# EAGLE design untitled (EAGLE 9.3.2)
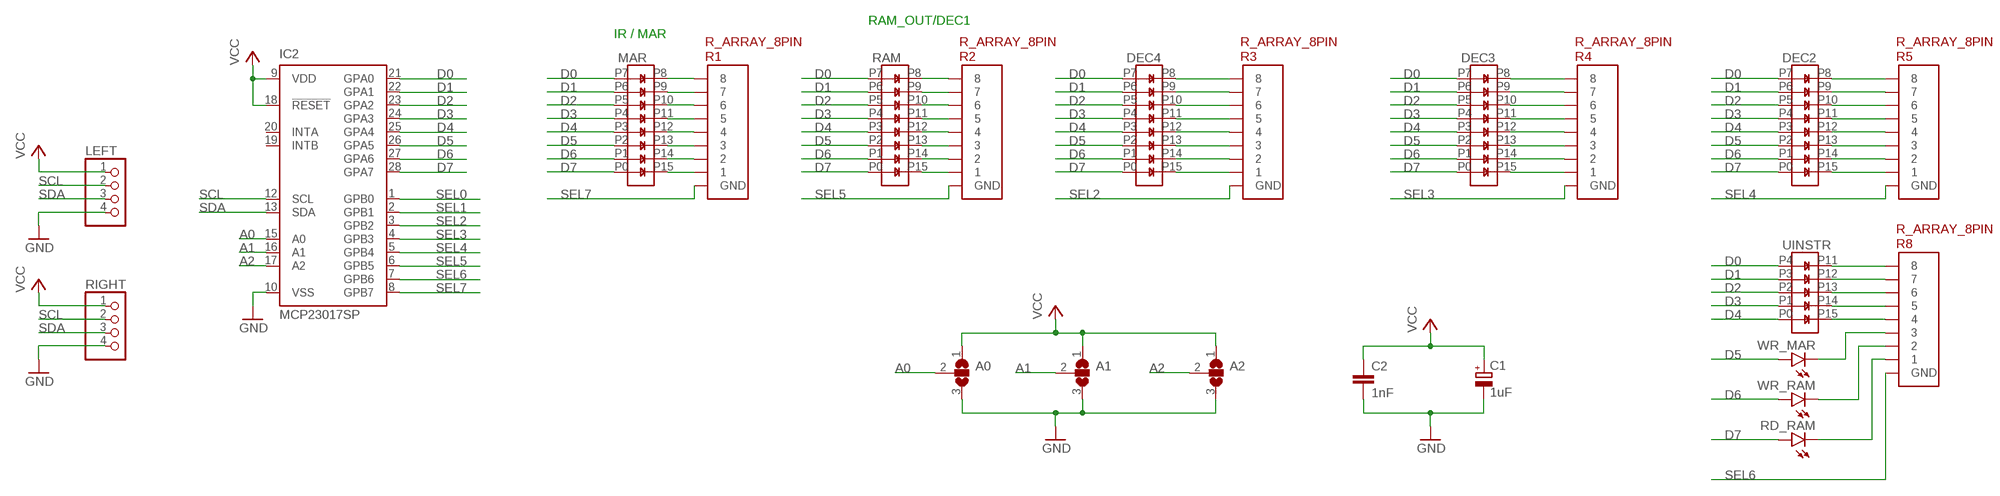
[diagram p0: schematic, sheet 1]

## Parts
A0  SJ2W  [SJ_2]
A1  SJ2W  [SJ_2]
A2  SJ2W  [SJ_2]
C1  1uF  CPOL-EUE2.5-6  [E2,5-6]
C2  1nF  C2.5/2  [C2.5-2]
DEC2  LB8  [LB8]
DEC3  LB8  [LB8]
DEC4  LB8  [LB8]
IC2  MCP23017SP  [DIL28-3]
LEFT  PINHD-1X4  [1X04]
MAR  LB8  [LB8]
R1  R_ARRAY_8PIN  [R_ARRAY_8PIN]
R2  R_ARRAY_8PIN  [R_ARRAY_8PIN]
R3  R_ARRAY_8PIN  [R_ARRAY_8PIN]
R4  R_ARRAY_8PIN  [R_ARRAY_8PIN]
R5  R_ARRAY_8PIN  [R_ARRAY_8PIN]
R8  R_ARRAY_8PIN  [R_ARRAY_8PIN]
RAM  LB8  [LB8]
RD_RAM  LED3MM  [LED3MM]
RIGHT  PINHD-1X4  [1X04]
UINSTR  LB5  [LB5]
WR_MAR  LED3MM  [LED3MM]
WR_RAM  LED3MM  [LED3MM]

## Nets
A0: A0.2 IC2.15(A0)
A1: A1.2 IC2.16(A1)
A2: A2.2 IC2.17(A2)
D0: DEC2.P7 DEC3.P7 DEC4.P7 IC2.21(GPA0) MAR.P7 RAM.P7 UINSTR.P4
D1: DEC2.P6 DEC3.P6 DEC4.P6 IC2.22(GPA1) MAR.P6 RAM.P6 UINSTR.P3
D2: DEC2.P5 DEC3.P5 DEC4.P5 IC2.23(GPA2) MAR.P5 RAM.P5 UINSTR.P2
D3: DEC2.P4 DEC3.P4 DEC4.P4 IC2.24(GPA3) MAR.P4 RAM.P4 UINSTR.P1
D4: DEC2.P3 DEC3.P3 DEC4.P3 IC2.25(GPA4) MAR.P3 RAM.P3 UINSTR.P0
D5: DEC2.P2 DEC3.P2 DEC4.P2 IC2.26(GPA5) MAR.P2 RAM.P2 WR_MAR.A
D6: DEC2.P1 DEC3.P1 DEC4.P1 IC2.27(GPA6) MAR.P1 RAM.P1 WR_RAM.A
D7: DEC2.P0 DEC3.P0 DEC4.P0 IC2.28(GPA7) MAR.P0 RAM.P0 RD_RAM.A
GND: A0.3 A1.3 A2.3 C1.- C2.2 IC2.10(VSS) LEFT.4 RIGHT.4
N$1: DEC4.P8 R3.8
N$2: DEC4.P9 R3.7
N$3: DEC4.P10 R3.6
N$4: DEC4.P11 R3.5
N$5: DEC4.P12 R3.4
N$6: DEC4.P13 R3.3
N$7: DEC4.P14 R3.2
N$8: DEC4.P15 R3.1
N$9: R8.3 WR_MAR.K(C)
N$10: R8.2 WR_RAM.K(C)
N$11: R8.1 RD_RAM.K(C)
N$17: MAR.P8 R1.8
N$18: MAR.P9 R1.7
N$19: MAR.P10 R1.6
N$20: MAR.P11 R1.5
N$21: MAR.P12 R1.4
N$22: MAR.P13 R1.3
N$23: MAR.P14 R1.2
N$24: MAR.P15 R1.1
N$25: R2.8 RAM.P8
N$26: R2.7 RAM.P9
N$27: R2.6 RAM.P10
N$28: R2.5 RAM.P11
N$29: R2.4 RAM.P12
N$30: R2.3 RAM.P13
N$31: R2.2 RAM.P14
N$32: R2.1 RAM.P15
N$42: DEC3.P8 R4.8
N$43: DEC3.P9 R4.7
N$44: DEC3.P10 R4.6
N$45: DEC3.P11 R4.5
N$46: DEC3.P12 R4.4
N$47: DEC3.P13 R4.3
N$48: DEC3.P14 R4.2
N$49: DEC3.P15 R4.1
N$50: DEC2.P8 R5.8
N$51: DEC2.P9 R5.7
N$52: DEC2.P10 R5.6
N$53: DEC2.P11 R5.5
N$54: DEC2.P12 R5.4
N$55: DEC2.P13 R5.3
N$56: DEC2.P14 R5.2
N$57: DEC2.P15 R5.1
N$58: R8.8 UINSTR.P11
N$59: R8.7 UINSTR.P12
N$60: R8.6 UINSTR.P13
N$61: R8.5 UINSTR.P14
N$62: R8.4 UINSTR.P15
SCL: IC2.12(SCL) LEFT.2 RIGHT.2
SDA: IC2.13(SDA) LEFT.3 RIGHT.3
SEL0: IC2.1(GPB0)
SEL1: IC2.2(GPB1)
SEL2: IC2.3(GPB2) R3.GND
SEL3: IC2.4(GPB3) R4.GND
SEL4: IC2.5(GPB4) R5.GND
SEL5: IC2.6(GPB5) R2.GND
SEL6: IC2.7(GPB6) R8.GND
SEL7: IC2.8(GPB7) R1.GND
VCC: A0.1 A1.1 A2.1 C1.+ C2.1 IC2.9(VDD) IC2.18(!RESET) LEFT.1 RIGHT.1
Unconnected: IC2.19(INTB) IC2.20(INTA)

## Notes on the sheet
- RAM_OUT/DEC1
- IR / MAR

## Library data of the parts
A0 A1 A2 = jumper:SJ2W: SMD solder JUMPER
C1 = rcl:CPOL-EU: POLARIZED CAPACITOR, European symbol; SPICEPREFIX: C
C2 = capacitor-wima:C: CAPACITOR naming: grid - package width
DEC2-DEC4 MAR RAM = 8bit_components:LB8
IC2 = microchip:MCP23017: http://ww1.microchip.com/downloads/en/DeviceDoc/21952a.pdf Source: http://ww1.microchip.com/downloads/en/DeviceDoc/21952a.pdf; MF: MICROCHIP; MPN: MCP23017-E/SP; OC_FARNELL: 1332088; OC_NEWARK: 31K2959
LEFT RIGHT = pinhead:PINHD-1X4: PIN HEADER
R1-R5 R8 = 8bit_components:R_ARRAY_8PIN
RD_RAM WR_MAR WR_RAM = led:LED: LED OSRAM: - CHIPLED LG R971, LG N971, LY N971, LG Q971, LY Q971, LO R971, LY R971 LH N974, LH R974 LS Q976, LO Q976, LY Q976 LO Q996 - Hyper CHIPLED LW Q18S LB Q993, LB Q99A, LB R99A - SideLED LS A670, LO A670, LY A670, LG A670, LP A670 LB A673, LV A673, LT A673, LW A673 LH A674 LY A675 LS A676, LA A676, LO A676, LY A676, LW A676 LS A679, LY A679, LG A679 - Hyper Micro SIDELED® LS Y876, LA Y876, LO Y876, LY Y876 LT Y87S - SmartLED LW L88C, LW L88S LB L89C, LB L89S, LG L890 LS L89K, LO L89K, LY L89K LS L896, LA L896, LO L896, LY L896 - TOPLED LS T670, LO T670, LY T670, LG T670, LP T670 LSG T670, LSP T670, LSY T670, LOP T670, LYG T670 LG T671, LOG T671, LSG T671 LB T673, LV T673, LT T673, LW T673 LH T674 LS T676, LA T676, LO T676, LY T676, LB T676, LH T676, LSB T676, LW T676 LB T67C, LV T67C, LT T67C, LS T67K, LO T67K, LY T67K, LW E67C LS E67B, LA E67B, LO E67B, LY E67B, LB E67C, LV E67C, LT E67C LW T67C LS T679, LY T679, LG T679 LS T770, LO T770, LY T770, LG T770, LP T770 LB T773, LV T773, LT T773, LW T773 LH T774 LS E675, LA E675, LY E675, LS T675 LS T776, LA T776, LO T776, LY T776, LB T776 LHGB T686 LT T68C, LB T68C - Hyper Mini TOPLED® LB M676 - Mini TOPLED Santana® LG M470 LS M47K, LO M47K, LY M47K Source: http://www.osram.convergy.de LUXEON: - LUMILED® LXK2-PW12-R00, LXK2-PW12-S00, LXK2-PW14-U00, LXK2-PW14-V00 LXK2-PM12-R00, LXK2-PM12-S00, LXK2-PM14-U00 LXK2-PE12-Q00, LXK2-PE12-R00, LXK2-PE12-S00, LXK2-PE14-T00, LXK2-PE14-U00 LXK2-PB12-K00, LXK2-PB12-L00, LXK2-PB12-M00, LXK2-PB14-N00, LXK2-PB14-P00, LXK2-PB14-Q00 LXK2-PR12-L00, LXK2-PR12-M00, LXK2-PR14-Q00, LXK2-PR14-R00 LXK2-PD12-Q00, LXK2-PD12-R00, LXK2-PD12-S00 LXK2-PH12-R00, LXK2-PH12-S00 LXK2-PL12-P00, LXK2-PL12-Q00, LXK2-PL12-R00 Source: www.luxeon.com KINGBRIGHT: KA-3528ASYC Source: www.kingbright.com
UINSTR = 8bit_components:LB5

## Board
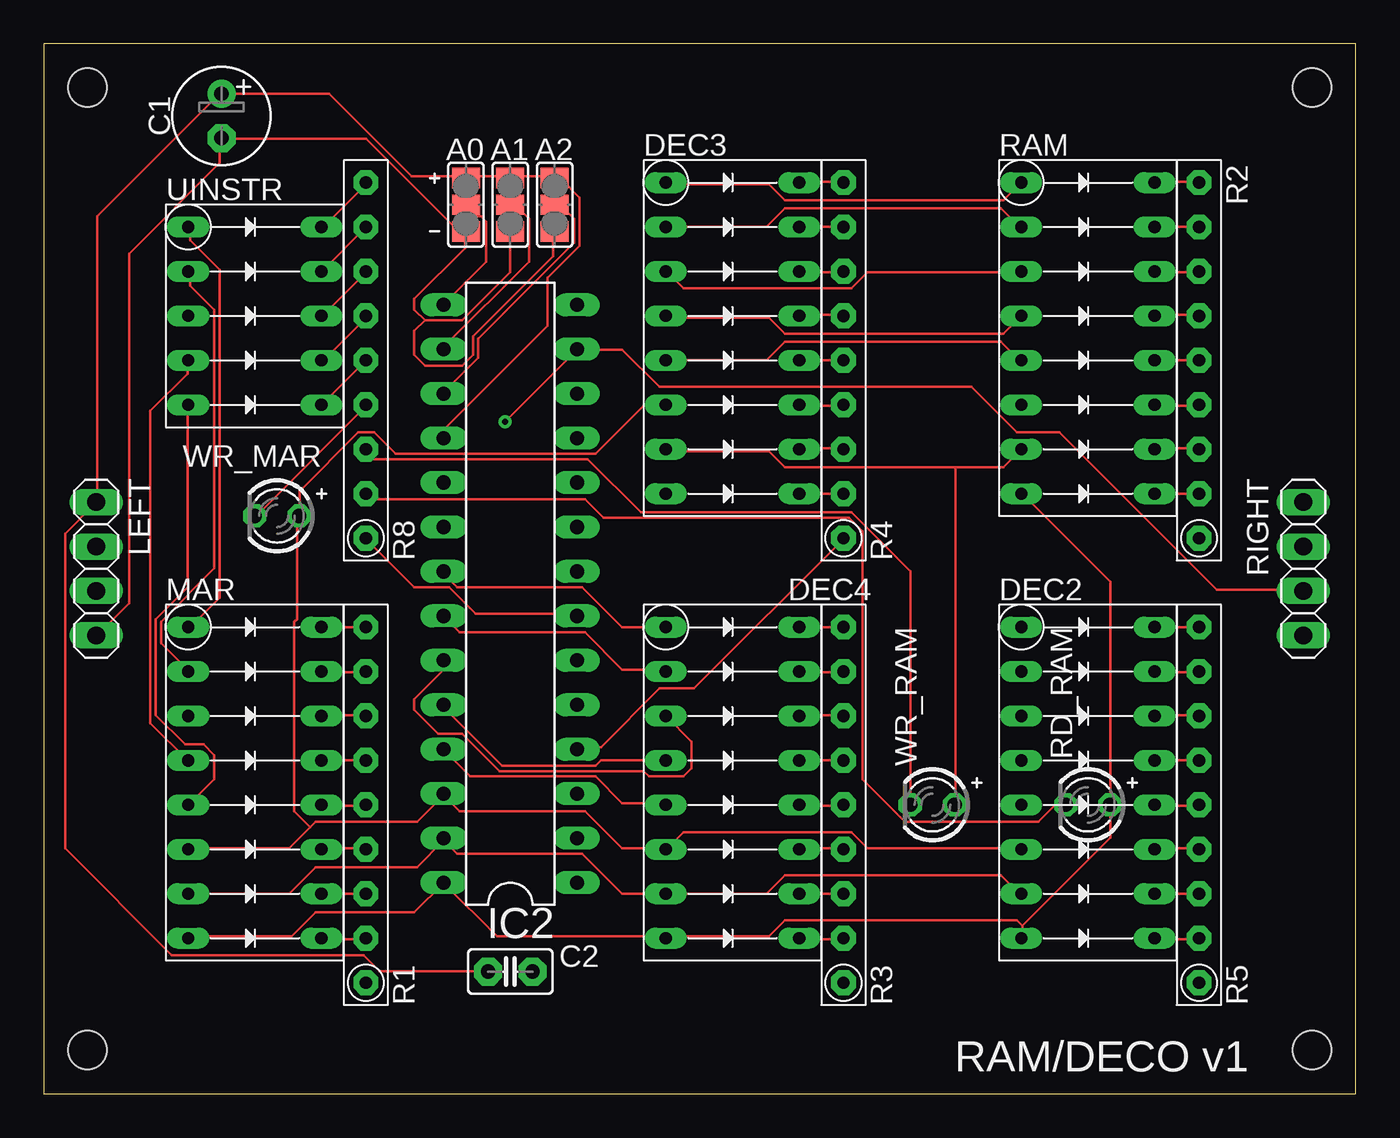
[diagram p1: board, top side]
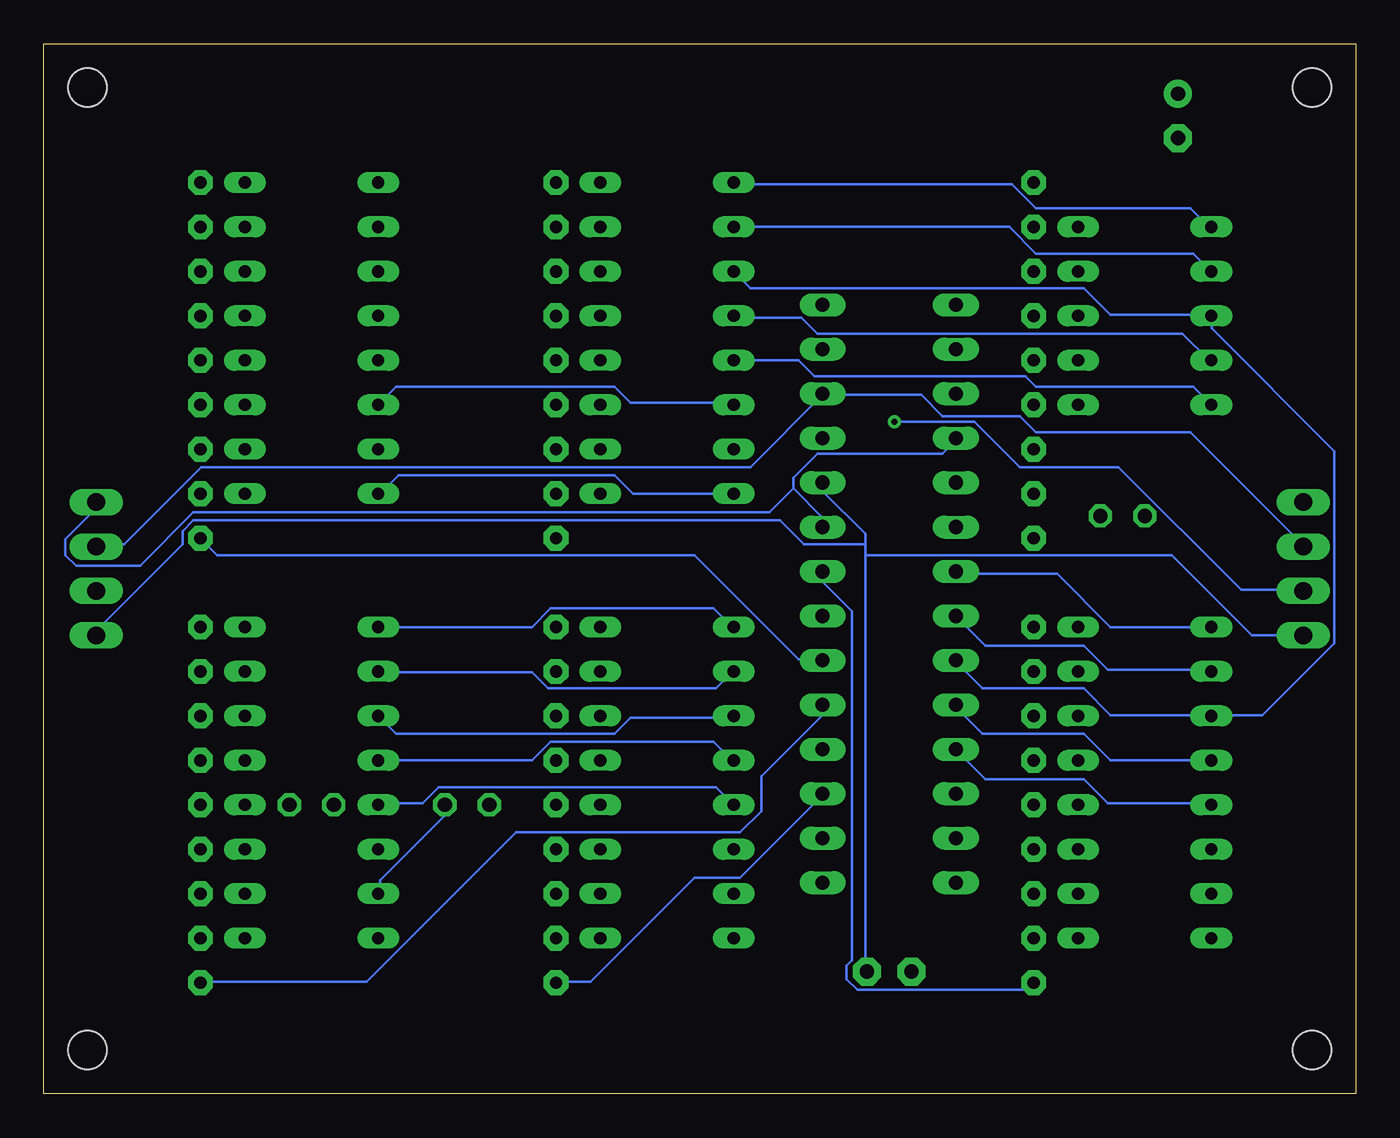
[diagram p2: board, bottom side, seen from below]

Size 75 x 60 mm. Coordinates in mm from the lower left corner, seen from the top.
Outline: 0,0 75,0 75,60 0,60 0,0
Copper layers (1*16): Top 0.035mm / dielectric 1.5mm / Bottom 0.035mm
Design rules "default": minimum track width 6mil, minimum drill 0.35mm, track to track 6mil, track to pad 6mil, pad to pad 6mil, via to via 6mil, smd to smd 6mil, copper to edge 40mil, drill to drill 6mil, minimum pad ring 10mil, minimum via ring 8mil, stop-mask expansion 4mil, vias tented up to drill 0mil, thermal gap 10mil
Holes 2.2 mm at 2.5,57.5 2.5,2.5 72.5,2.5 72.5,57.5

### Footprints (pad centres in the part's own frame; a part is rotated, then mirrored left to right if it is on the bottom)
SJ_2 = smd 1.168 x 1.6: 1 -1.524,0; 2 0,0; 3 1.524,0
E2,5-6 = drill 0.813 pad 1.6: + -1.27,0 | drill 0.813 pad 1.6 octagon: - 1.27,0
C2.5-2 = drill 0.813 pad 1.6 octagon: 1 -1.27,0; 2 1.27,0
LB8 = drill 0.7 long: P0 -3.81,-8.89; P1 -3.81,-6.35; P2 -3.81,-3.81; P3 -3.81,-1.27; P4 -3.81,1.27; P5 -3.81,3.81; P6 -3.81,6.35; P7 -3.81,8.89; P8 3.81,8.89; P9 3.81,6.35; P10 3.81,3.81; P11 3.81,1.27; P12 3.81,-1.27; P13 3.81,-3.81; P14 3.81,-6.35; P15 3.81,-8.89
DIL28-3 = drill 0.813 long: 1 -16.51,-3.81; 2 -13.97,-3.81; 3 -11.43,-3.81; 4 -8.89,-3.81; 5 -6.35,-3.81; 6 -3.81,-3.81; 7 -1.27,-3.81; 8 1.27,-3.81; 9 3.81,-3.81; 10 6.35,-3.81; 11 8.89,-3.81; 12 11.43,-3.81; 13 13.97,-3.81; 14 16.51,-3.81; 15 16.51,3.81; 16 13.97,3.81; 17 11.43,3.81; 18 8.89,3.81; 19 6.35,3.81; 20 3.81,3.81; 21 1.27,3.81; 22 -1.27,3.81; 23 -3.81,3.81; 24 -6.35,3.81; 25 -8.89,3.81; 26 -11.43,3.81; 27 -13.97,3.81; 28 -16.51,3.81
1X04 = drill 1.016 long: 1 -3.81,0; 2 -1.27,0; 3 1.27,0; 4 3.81,0
R_ARRAY_8PIN = drill 0.7 pad 1.422 octagon: 1 0,-7.62; 2 0,-5.08; 3 0,-2.54; 4 0,0; 5 0,2.54; 6 0,5.08; 7 0,7.62; 8 0,10.16; GND 0,-10.16
LED3MM = drill 0.813 octagon: A -1.27,0; K 1.27,0
LB5 = drill 0.7 long: P0 -2.54,-5.08; P1 -2.54,-2.54; P2 -2.54,0; P3 -2.54,2.54; P4 -2.54,5.08; P11 5.08,5.08; P12 5.08,2.54; P13 5.08,0; P14 5.08,-2.54; P15 5.08,-5.08

### Placement (x,y rotation side)
A0  24.13,50.8 270 top
A1  26.67,50.8 270 top
A2  29.21,50.8 270 top
C1  10.16,55.88 270 top
C2  26.67,6.99 0 top
DEC2  59.69,17.78 0 top
DEC3  39.37,43.18 0 top
DEC4  39.37,17.78 0 top
IC2  26.67,28.57 90 top
LEFT  3,30 270 top
MAR  12.06,17.78 0 top
R1  18.41,16.51 0 top
R2  66.04,41.91 0 top
R3  45.72,16.51 0 top
R4  45.72,41.91 0 top
R5  66.04,16.51 0 top
R8  18.41,41.91 0 top
RAM  59.69,43.18 0 top
RD_RAM  59.69,16.51 180 top
RIGHT  72,30 270 top
UINSTR  10.79,44.45 0 top
WR_MAR  13.34,33.02 180 top
WR_RAM  50.8,16.51 180 top

### Tracks (layer width: path | path; a pad name or v marks a point on that pad's centre or on a via)
A0
  Top 0.152: A0.2 24.23,50.75 24.84,50.14 24.99,50.14 25.3,49.84 25.3,47.55 22.86,45.11 IC2.15
A1
  Top 0.152: A1.2 26.67,50.75 26.98,50.75 27.74,49.99 27.74,47.55 22.86,42.67 IC2.16
A2
  Top 0.152: A2.2 29.26,50.75 29.57,50.75 30.33,49.99 30.33,48.62 24.84,43.13 24.84,42.06 22.86,40.08 IC2.17
D0
  Top 0.152: RAM.P7 54.86,51.05 42.37,51.05 41.45,51.97 35.66,51.97 DEC3.P7 | UINSTR.P4 8.38,49.53 8.38,48.77 10.06,47.09 10.06,28.35 8.38,26.67 MAR.P7 | DEC4.P7 33.07,26.67 30.79,28.96 23.62,28.96 22.86,29.72 IC2.21
  Bottom 0.152: MAR.P7 14.02,26.67 17.07,29.72 22.86,29.72 IC2.21 | DEC2.P7 47.09,26.67 46.02,27.74 36.73,27.74 35.66,26.67 DEC4.P7 | DEC3.P7 35.51,51.97 19.66,51.97 18.29,50.6 9.45,50.6 8.38,49.53 UINSTR.P4
D1
  Top 0.152: DEC3.P6 41.3,49.53 42.37,50.6 54.71,50.6 55.78,49.53 RAM.P6 | DEC4.P6 35.51,24.23 33.07,24.23 30.94,26.36 23.77,26.36 22.86,27.28 IC2.22 | UINSTR.P3 8.38,46.94 8.38,46.18 9.75,44.81 9.75,30.02 6.71,26.98 6.71,25.76 8.23,24.23 MAR.P6
  Bottom 0.152: MAR.P6 8.38,24.23 14.17,24.23 15.54,25.6 21.18,25.6 22.86,27.28 IC2.22 | DEC2.P6 55.78,24.08 47.09,24.08 46.18,23.16 36.58,23.16 35.66,24.08 DEC4.P6 | DEC3.P6 19.81,49.53 18.29,48.01 9.3,48.01 8.38,47.09 UINSTR.P3
D2
  Top 0.152: RAM.P5 55.78,46.94 47.09,46.94 46.18,46.02 36.58,46.02 35.66,46.94 DEC3.P5 | IC2.23 22.86,24.23 21.18,22.55 21.18,21.95 22.55,20.57 23.93,20.57 26.06,18.44 34.29,18.44 34.59,18.14 36.58,18.14 37.03,18.59 37.03,20.12 DEC4.P5
  Bottom 0.152: DEC3.P5 34.59,46.02 15.54,46.02 14.02,44.5 8.38,44.5 UINSTR.P2 8.23,44.35 8.23,43.74 1.22,36.73 1.22,25.76 5.33,21.64 8.23,21.64 MAR.P5 8.38,21.64 14.02,21.64 15.54,23.16 21.34,23.16 22.86,24.69 IC2.23 | DEC2.P5 54.86,20.57 42.37,20.57 41.45,21.49 35.66,21.49 DEC4.P5
D3
  Top 0.152: RAM.P4 54.86,43.43 42.37,43.43 41.45,44.35 35.66,44.35 DEC3.P4 | DEC4.P4 31.85,19.05 31.55,18.75 26.21,18.75 22.86,22.1 IC2.24 | UINSTR.P1 8.23,41.91 8.23,41.15 6.1,39.01 6.1,21.18 8.23,19.05 MAR.P4
  Bottom 0.152: MAR.P4 14.02,19.05 15.54,20.57 21.34,20.57 22.86,22.1 IC2.24 | DEC2.P4 47.09,19.05 46.02,20.12 36.73,20.12 35.66,19.05 DEC4.P4 | DEC3.P4 35.51,44.35 31.7,44.35 30.79,43.43 9.91,43.43 8.38,41.91 UINSTR.P1
D4
  Top 0.152: DEC3.P3 41.3,41.91 42.37,42.98 54.71,42.98 55.78,41.91 RAM.P3 | DEC4.P3 35.51,16.61 33.07,16.61 31.55,18.14 24.38,18.14 22.86,19.66 IC2.25 | UINSTR.P0 8.23,39.32 8.23,28.96 6.4,27.13 6.4,21.64 8.08,19.96 9.14,19.96 9.75,19.36 9.75,17.98 8.38,16.61 MAR.P3
  Bottom 0.152: MAR.P3 8.38,16.61 14.17,16.61 15.54,17.98 21.18,17.98 22.86,19.66 IC2.25 | DEC4.P3 36.58,17.53 52.43,17.53 53.34,16.61 55.78,16.61 DEC2.P3 | DEC3.P3 31.85,41.91 30.94,41 18.9,41 18.29,40.39 9.3,40.39 8.38,39.47 UINSTR.P0
D5
  Top 0.152: 15.24,15.24 15.54,15.54 21.34,15.54 22.86,17.07 | 15.24,15.24 14.02,14.02 8.38,14.02 MAR.P2 | 22.86,17.07 23.77,16.15 30.94,16.15 33.07,14.02 35.51,14.02 DEC4.P2 35.66,14.02 36.58,14.94 46.18,14.94 47.09,14.02 55.78,14.02 DEC2.P2 | 22.86,17.07 IC2.26 | 15.24,15.24 14.33,16.15 14.33,26.98 14.48,27.13 14.48,32.92 WR_MAR.A 14.63,33.07 14.63,34.44 17.98,37.8 18.9,37.8 20.12,36.58 31.55,36.58 34.29,39.32 35.51,39.32 DEC3.P2
  Bottom 0.152: RAM.P2 54.86,40.39 42.37,40.39 41.45,39.47 35.66,39.47 DEC3.P2
D6
  Top 0.152: MAR.P1 14.02,11.43 15.54,12.95 21.34,12.95 22.86,14.48 | 22.86,14.48 23.62,13.72 30.79,13.72 33.07,11.43 DEC4.P1 41.3,11.43 42.37,12.5 54.71,12.5 55.78,11.43 DEC2.P1 | 22.86,14.48 IC2.27 | 52.12,35.81 54.86,35.81 RAM.P1 | 52.12,35.81 42.37,35.81 41.45,36.73 35.66,36.73 DEC3.P1 | 52.12,35.81 52.12,16.61 WR_RAM.A
  Bottom 0.152: DEC2.P1 55.78,11.43 55.78,12.19 52.12,15.85 52.12,16.46 WR_RAM.A
D7
  Top 0.152: 22.86,12.04 21.18,10.36 15.54,10.36 14.17,8.99 8.38,8.99 MAR.P0 | 22.86,12.04 25.91,8.99 35.51,8.99 DEC4.P0 35.66,8.99 41.45,8.99 42.37,9.91 55.63,9.91 55.93,9.6 | 22.86,12.04 IC2.28 | 55.93,9.6 55.93,8.99 DEC2.P0 | 55.93,9.6 60.96,14.63 RD_RAM.A 60.96,29.26 55.93,34.29 RAM.P0
  Bottom 0.152: DEC3.P0 41.3,34.29 42.37,35.36 54.71,35.36 55.78,34.29 RAM.P0
GND
  Top 0.152: 21.79,44.2 21.18,44.81 21.18,45.41 24.08,48.31 24.08,49.23 A0.3 24.08,49.38 23.62,49.38 18.44,54.56 10.21,54.56 C1.- 10.06,54.56 10.06,53.19 4.88,48.01 4.88,28.04 3.05,26.21 LEFT.4 | 21.79,44.2 23.93,44.2 26.67,46.94 A1.3 | 21.79,44.2 21.18,43.59 21.18,42.22 21.79,41.6 23.93,41.6 24.54,42.22 24.54,43.28 29.11,47.85 29.11,49.23 A2.3
  Bottom 0.152: IC2.10 30.48,34.44 28.04,32 28.04,31.39 | 28.04,30.79 28.04,7.01 C2.2 | 28.04,30.79 28.04,31.39 | 28.04,30.79 10.52,30.79 5.94,26.21 3.05,26.21 LEFT.4 | 28.04,31.39 31.55,31.39 32.92,32.77 66.45,32.77 67.06,32.16 67.06,31.39 71.93,26.52 71.93,26.21 RIGHT.4
N$1
  Top 0.152: R3.8 DEC4.P8
N$2
  Top 0.152: DEC4.P9 43.28,24.08 45.72,24.08 R3.7
N$3
  Top 0.152: DEC4.P10 43.28,21.64 45.72,21.64 R3.6
N$4
  Top 0.152: R3.5 DEC4.P11
N$5
  Top 0.152: DEC4.P12 43.28,16.46 45.72,16.46 R3.4
N$6
  Top 0.152: DEC4.P13 43.28,14.02 45.72,14.02 R3.3
N$7
  Top 0.152: R3.2 DEC4.P14
N$8
  Top 0.152: DEC4.P15 43.28,8.84 45.72,8.84 R3.1
N$9
  Top 0.152: WR_MAR.K 12.19,33.07 18.44,39.32 R8.3
N$10
  Top 0.152: WR_RAM.K 49.53,29.87 46.18,33.22 34.14,33.22 31.09,36.27 18.9,36.27 18.44,36.73 R8.2
N$11
  Top 0.152: RD_RAM.K 58.37,16.46 57.76,16.46 56.84,15.54 49.23,15.54 46.79,17.98 46.79,32.16 46.02,32.92 32,32.92 30.94,33.98 18.75,33.98 18.44,34.29 R8.1
N$17
  Top 0.152: R1.8 MAR.P8
N$18
  Top 0.152: MAR.P9 16,24.08 18.29,24.08 R1.7
N$19
  Top 0.152: MAR.P10 16,21.64 18.29,21.64 R1.6
N$20
  Top 0.152: R1.5 MAR.P11
N$21
  Top 0.152: MAR.P12 16,16.46 18.29,16.46 R1.4
N$22
  Top 0.152: MAR.P13 16,14.02 18.29,14.02 R1.3
N$23
  Top 0.152: R1.2 MAR.P14
N$24
  Top 0.152: MAR.P15 16,8.84 18.29,8.84 R1.1
N$25
  Top 0.152: RAM.P8 63.55,52.12 65.99,52.12 R2.8
N$26
  Top 0.152: R2.7 RAM.P9
N$27
  Top 0.152: RAM.P10 63.55,46.94 65.99,46.94 R2.6
N$28
  Top 0.152: RAM.P11 63.55,44.5 65.99,44.5 R2.5
N$29
  Top 0.152: R2.4 RAM.P12
N$30
  Top 0.152: RAM.P13 63.55,39.32 65.99,39.32 R2.3
N$31
  Top 0.152: RAM.P14 63.55,36.88 65.99,36.88 R2.2
N$32
  Top 0.152: R2.1 RAM.P15
N$42
  Top 0.152: DEC3.P8 43.28,52.12 45.72,52.12 R4.8
N$43
  Top 0.152: R4.7 DEC3.P9
N$44
  Top 0.152: DEC3.P10 43.28,46.94 45.72,46.94 R4.6
N$45
  Top 0.152: DEC3.P11 43.28,44.5 45.72,44.5 R4.5
N$46
  Top 0.152: R4.4 DEC3.P12
N$47
  Top 0.152: DEC3.P13 43.28,39.32 45.72,39.32 R4.3
N$48
  Top 0.152: DEC3.P14 43.28,36.88 45.72,36.88 R4.2
N$49
  Top 0.152: R4.1 DEC3.P15
N$50
  Top 0.152: R5.8 DEC2.P8
N$51
  Top 0.152: DEC2.P9 63.55,24.08 65.99,24.08 R5.7
N$52
  Top 0.152: DEC2.P10 63.55,21.64 65.99,21.64 R5.6
N$53
  Top 0.152: R5.5 DEC2.P11
N$54
  Top 0.152: DEC2.P12 63.55,16.46 65.99,16.46 R5.4
N$55
  Top 0.152: DEC2.P13 63.55,14.02 65.99,14.02 R5.3
N$56
  Top 0.152: R5.2 DEC2.P14
N$57
  Top 0.152: DEC2.P15 63.55,8.84 65.99,8.84 R5.1
N$58
  Top 0.152: UINSTR.P11 16,49.53 18.44,51.97 R8.8
N$59
  Top 0.152: UINSTR.P12 16,47.09 18.44,49.53 R8.7
N$60
  Top 0.152: UINSTR.P13 16,44.5 18.44,46.94 R8.6
N$61
  Top 0.152: UINSTR.P14 16,41.91 18.44,44.35 R8.5
N$62
  Top 0.152: UINSTR.P15 16,39.47 18.44,41.91 R8.4
SCL
  Bottom 0.152: 30.48,39.93 24.84,39.93 23.62,38.71 19.2,38.71 18.29,37.8 9.45,37.8 3.05,31.39 LEFT.2 | 30.48,39.93 34.59,35.81 65.99,35.81 70.41,31.39 71.93,31.39 RIGHT.2 | 30.48,39.93 IC2.12
SDA  (via drill 0.35)
  Top 0.152: 30.48,42.52 33.07,42.52 35.2,40.39 53.03,40.39 55.63,37.8 58.06,37.8 67.06,28.8 71.93,28.8 RIGHT.3 | 30.48,42.52 v26.36,38.41 | 30.48,42.52 IC2.13
  Bottom 0.152: v26.36,38.41 21.79,38.41 19.2,35.81 13.56,35.81 6.55,28.8 3.05,28.8 LEFT.3
SEL2
  Bottom 0.152: IC2.3 30.48,17.07 35.2,12.34 37.8,12.34 43.74,6.4 45.72,6.4 R3.GND
SEL3
  Top 0.152: IC2.4 30.48,19.81 31.85,19.81 35.2,23.16 37.19,23.16 45.72,31.7 R4.GND
SEL4
  Bottom 0.152: IC2.5 30.48,21.64 33.98,18.14 33.98,16.15 35.2,14.94 48.01,14.94 56.54,6.4 65.99,6.4 R5.GND
SEL5
  Bottom 0.152: R2.GND 65.08,30.79 37.8,30.79 31.85,24.84 30.48,24.84 IC2.6
SEL6
  Top 0.152: IC2.7 30.48,27.43 24.69,27.43 23.16,28.96 21.18,28.96 18.44,31.7 R8.GND
SEL7
  Bottom 0.152: IC2.8 30.48,29.26 28.8,27.58 28.8,7.62 29.11,7.32 29.11,6.55 28.5,5.94 18.75,5.94 18.44,6.25 R1.GND
VCC
  Top 0.152: 26.67,52.43 24.23,52.43 A0.1 24.08,52.43 21.03,52.43 16.31,57.15 C1.+ 10.06,57.15 3.05,50.14 3.05,33.83 LEFT.1 2.9,33.68 1.22,32 1.22,14.02 7.32,7.92 18.29,7.92 19.2,7.01 25.3,7.01 C2.1 | 26.67,52.43 29.11,52.43 A2.1 29.26,52.27 29.57,52.27 30.63,51.21 30.63,48.46 28.8,46.63 28.8,43.89 22.86,37.95 IC2.18 | 26.67,52.43 A1.1
  Bottom 0.152: IC2.9 30.48,32.92 32.16,34.59 | 32.16,34.59 32.16,35.2 30.79,36.58 23.62,36.58 22.86,37.34 IC2.18 | 32.16,34.59 33.53,33.22 66.45,33.22 69.49,30.18 73.15,30.18 73.76,30.79 73.76,31.7 72.08,33.38 72.08,33.68 RIGHT.1

### Text on the board
tPlace: RAM/DECO v1